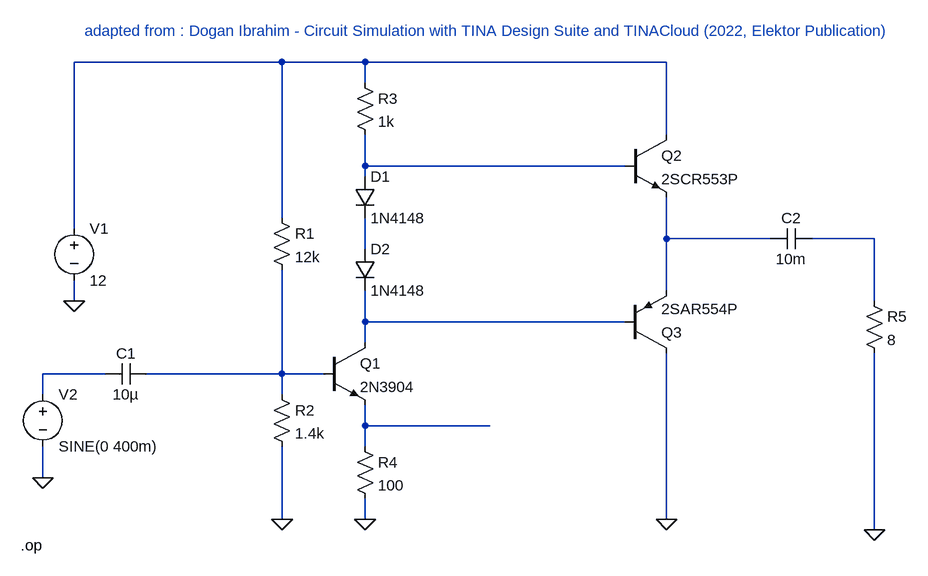
[diagram p0: schematic TINA.asc]
TINA.asc, the LTspice schematic file:
Version 4
SHEET 1 1316 680
WIRE 256 -192 -64 -192
WIRE 384 -192 256 -192
WIRE 848 -192 384 -192
WIRE 384 -160 384 -192
WIRE 848 -80 848 -192
WIRE 384 -32 384 -80
WIRE 784 -32 384 -32
WIRE 384 -16 384 -32
WIRE 256 48 256 -192
WIRE -64 64 -64 -192
WIRE 848 80 848 16
WIRE 1008 80 848 80
WIRE 1168 80 1072 80
WIRE 384 96 384 48
WIRE 848 160 848 80
WIRE -64 176 -64 144
WIRE 1168 176 1168 80
WIRE 384 208 384 160
WIRE 784 208 384 208
WIRE 384 240 384 208
WIRE -16 288 -112 288
WIRE 256 288 256 128
WIRE 256 288 48 288
WIRE 320 288 256 288
WIRE -112 320 -112 288
WIRE 256 320 256 288
WIRE 384 368 384 336
WIRE 576 368 384 368
WIRE 384 400 384 368
WIRE -112 448 -112 400
WIRE 256 512 256 400
WIRE 384 512 384 480
WIRE 848 512 848 256
WIRE 1168 528 1168 256
FLAG -64 176 0
FLAG -112 448 0
FLAG 256 512 0
FLAG 384 512 0
FLAG 848 512 0
FLAG 1168 528 0
DATAFLAG 880 80 ""
DATAFLAG 608 -32 ""
DATAFLAG 592 208 ""
DATAFLAG 144 288 ""
DATAFLAG 480 368 ""
SYMBOL voltage -64 48 R0
SYMATTR InstName V1
SYMATTR Value 12
SYMBOL res 240 32 R0
SYMATTR InstName R1
SYMATTR Value 12k
SYMBOL res 240 304 R0
SYMATTR InstName R2
SYMATTR Value 1.4k
SYMBOL npn 320 240 R0
SYMATTR InstName Q1
SYMATTR Value 2N3904
SYMBOL npn 784 -80 R0
SYMATTR InstName Q2
SYMATTR Value 2SCR553P
SYMBOL pnp 784 256 M180
SYMATTR InstName Q3
SYMATTR Value 2SAR554P
SYMBOL res 368 -176 R0
SYMATTR InstName R3
SYMATTR Value 1k
SYMBOL res 368 384 R0
SYMATTR InstName R4
SYMATTR Value 100
SYMBOL res 1152 160 R0
SYMATTR InstName R5
SYMATTR Value 8
SYMBOL voltage -112 304 R0
WINDOW 123 0 0 Left 0
WINDOW 39 0 0 Left 0
SYMATTR InstName V2
SYMATTR Value SINE(0 400m)
SYMBOL cap 48 272 R90
WINDOW 0 0 32 VBottom 2
WINDOW 3 32 32 VTop 2
SYMATTR InstName C1
SYMATTR Value 10µ
SYMBOL cap 1072 64 R90
WINDOW 0 0 32 VBottom 2
WINDOW 3 32 32 VTop 2
SYMATTR InstName C2
SYMATTR Value 10m
SYMBOL diode 368 -16 R0
SYMATTR InstName D1
SYMATTR Value 1N4148
SYMBOL diode 368 96 R0
SYMATTR InstName D2
SYMATTR Value 1N4148
TEXT -146 552 Left 2 !.op
TEXT -48 -240 Left 2 ;adapted from : Dogan Ibrahim - Circuit Simulation with TINA Design Suite and TINACloud (2022, Elektor Publication)

The netlist it stands for:
* TINA.asc
V1 N001 0 12
R1 N001 N008 12k
R2 N008 0 1.4k
Q1 N006 N008 N009 0 2N3904
Q2 N001 N002 N003 0 2SCR553P
Q3 0 N006 N003 0 2SAR554P
R3 N001 N002 1k
R4 N009 0 100
R5 N004 0 8
V2 N007 0 SINE(0 400m)
C1 N008 N007 10µ
C2 N004 N003 10m
D1 N002 N005 1N4148
D2 N005 N006 1N4148
.model D D
.lib standard.dio
.model NPN NPN
.model PNP PNP
.lib standard.bjt
.op
* adapted from : Dogan Ibrahim - Circuit Simulation with TINA Design Suite and TINACloud (2022, Elektor Publication)
.backanno
.end